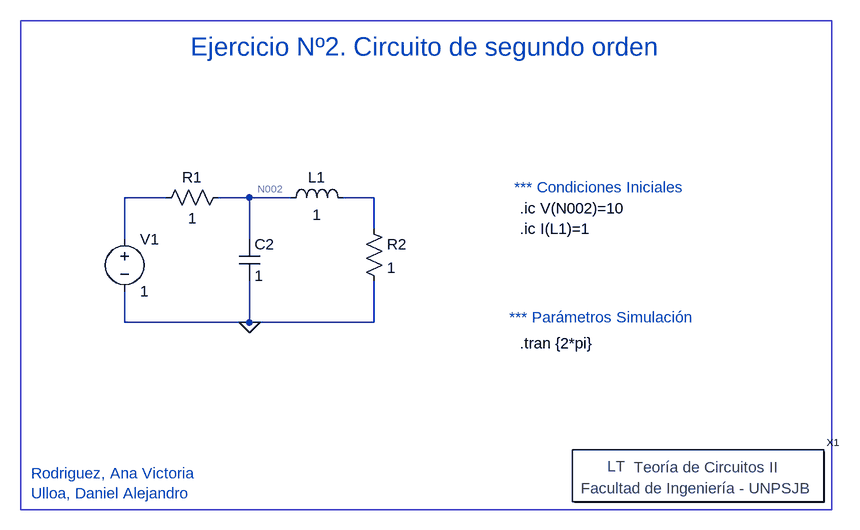
[diagram p0: schematic 02.asc]
02.asc, the LTspice schematic file:
Version 4
SHEET 1 900 680
WIRE -128 16 -192 16
WIRE 0 16 -48 16
WIRE 64 16 0 16
WIRE 192 16 144 16
WIRE 192 64 192 16
WIRE -192 80 -192 16
WIRE 0 80 0 16
WIRE -192 208 -192 160
WIRE 0 208 0 144
WIRE 0 208 -192 208
WIRE 192 208 192 144
WIRE 192 208 0 208
FLAG 0 208 0
SYMBOL Circuitos2\\Letreros\\Teoría\ de\ Circuitos\ II 688 448 R0
SYMATTR InstName X1
SYMBOL voltage -192 64 R0
SYMATTR InstName V1
SYMATTR Value 1
SYMBOL res -32 0 R90
WINDOW 0 0 56 VBottom 2
WINDOW 3 32 56 VTop 2
SYMATTR InstName R1
SYMATTR Value 1
SYMBOL cap -16 80 R0
SYMATTR InstName C2
SYMATTR Value 1
SYMBOL ind 48 32 R270
WINDOW 0 32 56 VTop 2
WINDOW 3 5 56 VBottom 2
SYMATTR InstName L1
SYMATTR Value 1
SYMATTR SpiceLine Rser=0
SYMBOL res 176 48 R0
SYMATTR InstName R2
SYMATTR Value 1
TEXT 272 -216 Center 4 ;Ejercicio Nº2. Circuito de segundo orden
TEXT -336 440 Left 2 ;Rodriguez, Ana Victoria\nUlloa, Daniel Alejandro
TEXT 408 0 Left 2 ;*** Condiciones Iniciales
TEXT 400 200 Left 2 ;*** Parámetros Simulación
TEXT 416 32 Left 2 !.ic V(N002)=10
TEXT 416 64 Left 2 !.ic I(L1)=1
TEXT 416 240 Left 2 !.tran {2*pi}
RECTANGLE Normal 896 496 -352 -256

The netlist it stands for:
* 02.asc
XX1 Teoría de Circuitos II
V1 N001 0 1
R1 N002 N001 1
C2 N002 0 1
L1 N002 N003 1 Rser=0
R2 N003 0 1
* Ejercicio Nº2. Circuito de segundo orden
* Rodriguez, Ana Victoria
* Ulloa, Daniel Alejandro
* *** Condiciones Iniciales
* *** Parámetros Simulación
.ic V(N002)=10
.ic I(L1)=1
.tran {2*pi}
.backanno
.end